# EAGLE design HendiRemoteInterface_v010 (EAGLE 9.5.2)
Wifi2Dmx Bridge WeMos D1 mini MAX485 (SO8) Neutrik NC1FAH1 5050 RGB LED BESTELLT: 30.06.2020
DNAME: Ruemmler, Elias
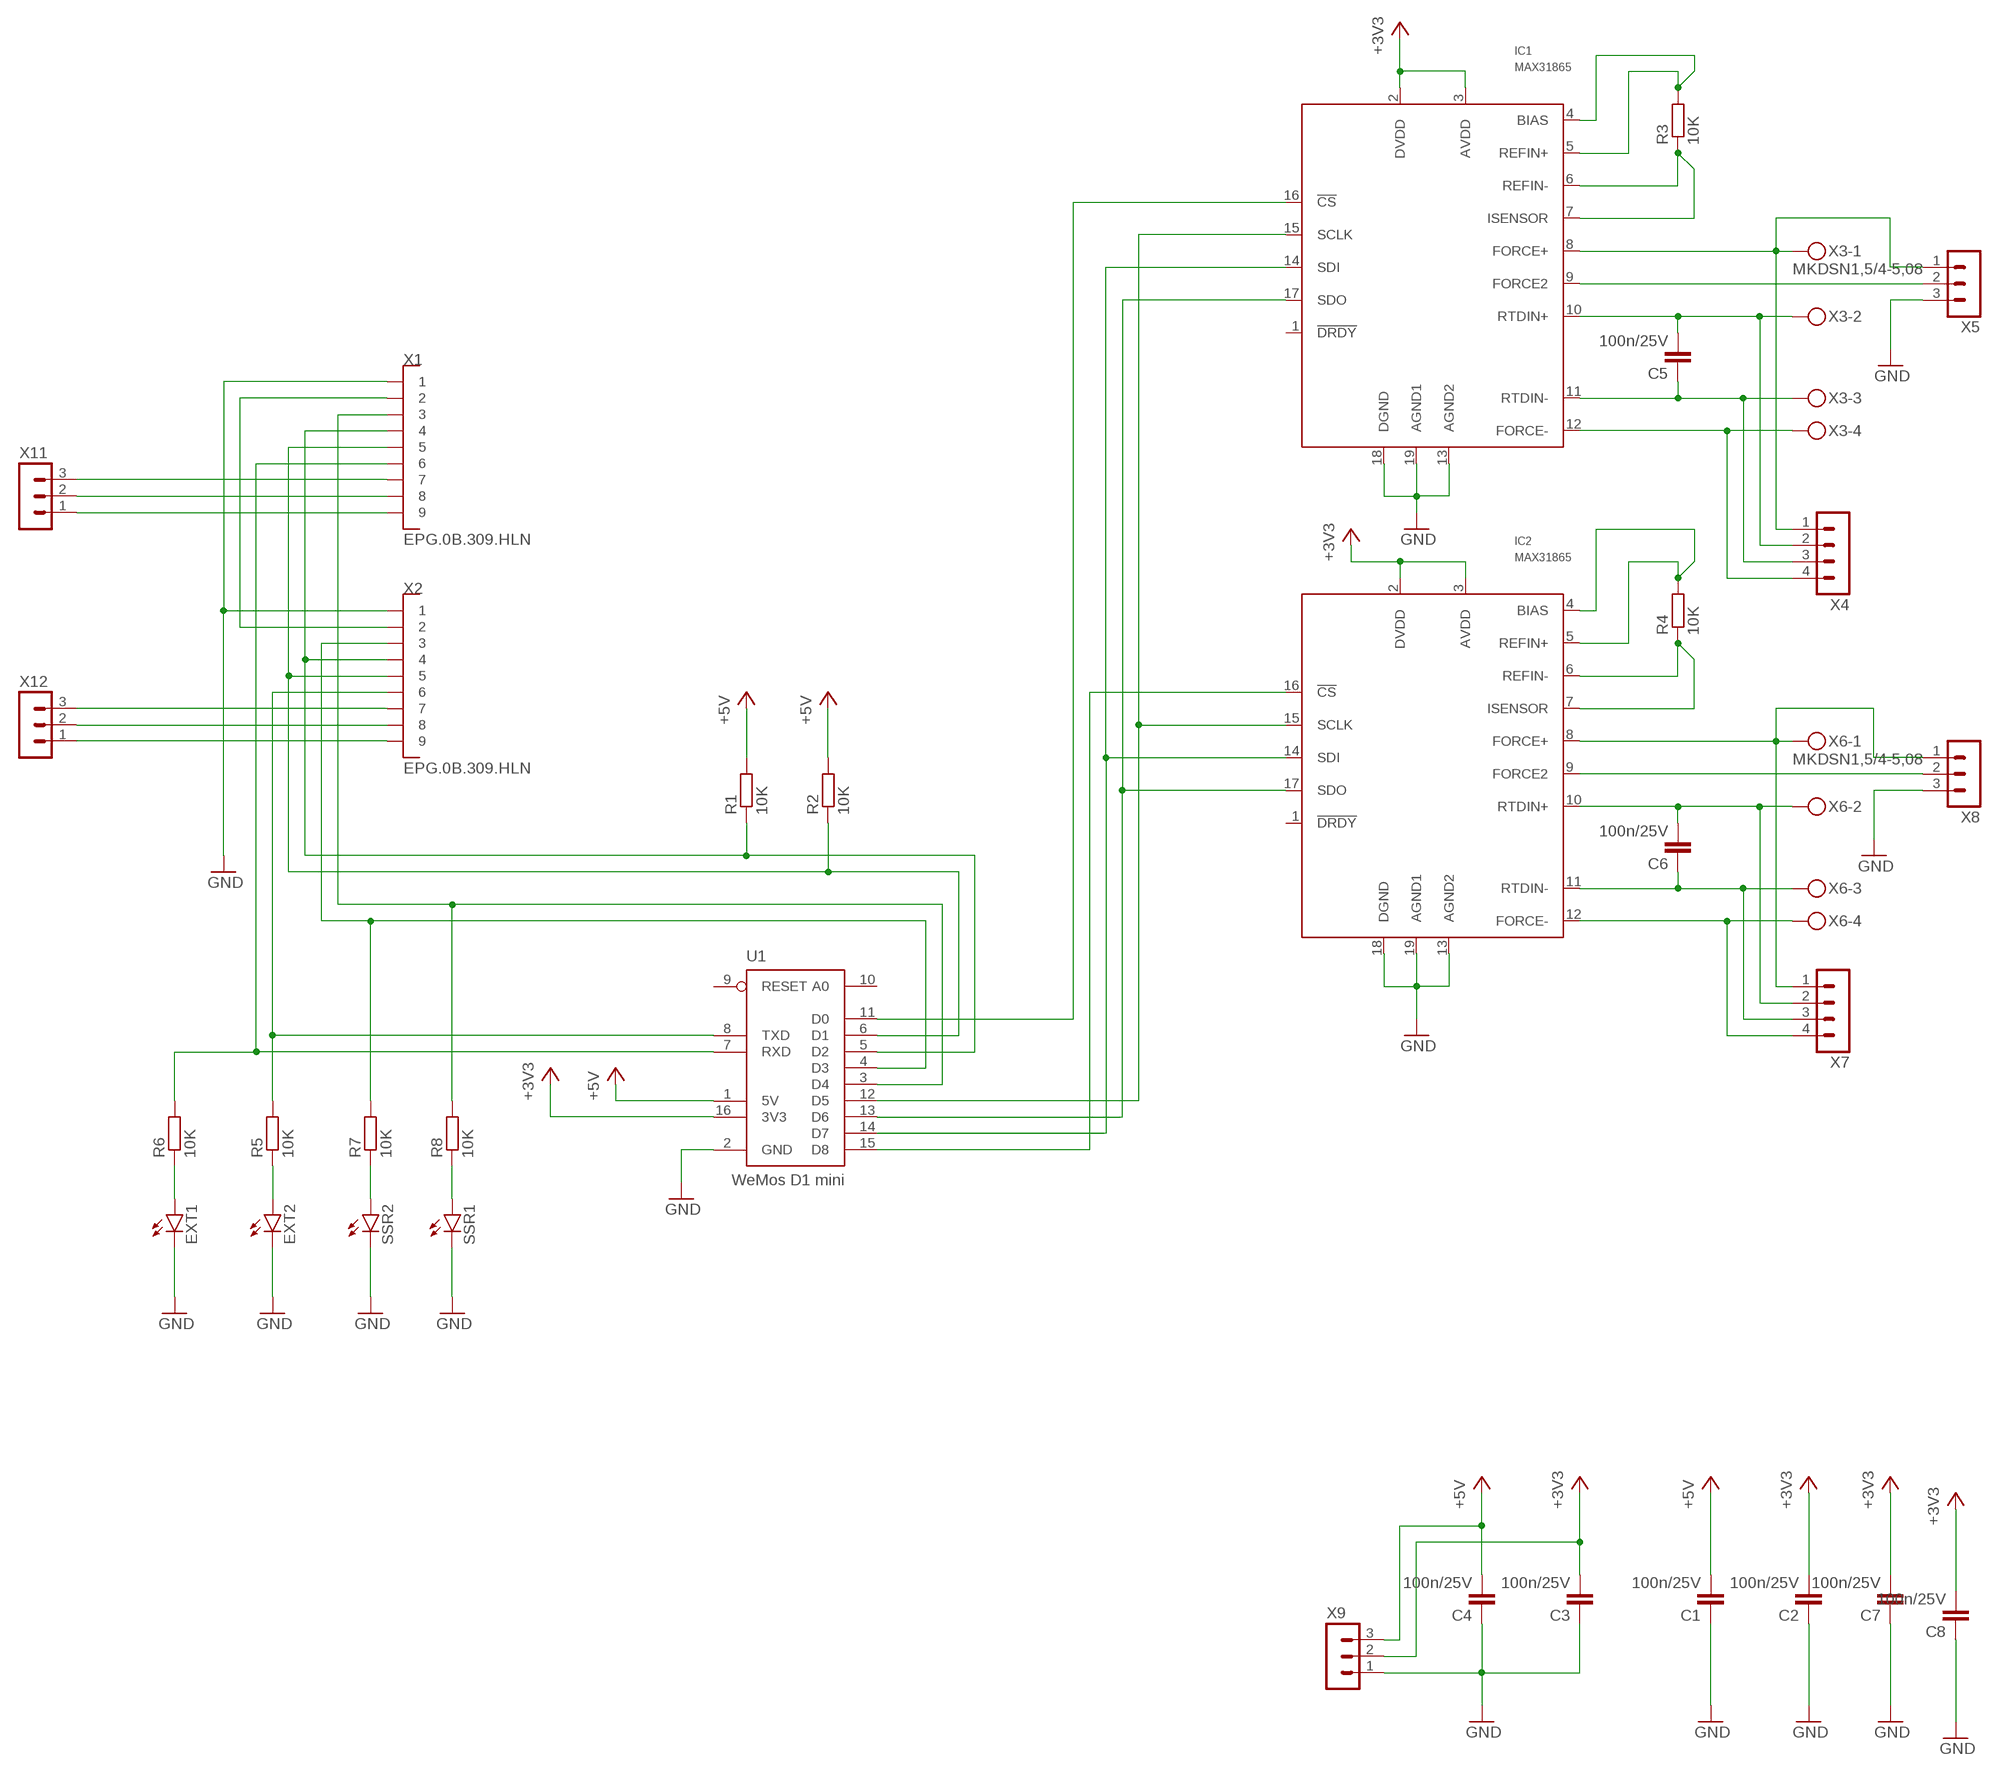
[diagram p0: schematic, sheet 1]

## Parts
C1  100n/25V  C-EUC0805  [C0805]
C2  100n/25V  C-EUC0805  [C0805]
C3  100n/25V  C-EUC0805  [C0805]
C4  100n/25V  C-EUC0805  [C0805]
C5  100n/25V  C-EUC0805  [C0805]
C6  100n/25V  C-EUC0805  [C0805]
C7  100n/25V  C-EUC0805  [C0805]
C8  100n/25V  C-EUC0805  [C0805]
EXT1  LEDCHIP-LED0805  [CHIP-LED0805]
EXT2  LEDCHIP-LED0805  [CHIP-LED0805]
IC1  MAX31865  MAX31865-SSOPSSOP  [SSOP20]
IC2  MAX31865  MAX31865-SSOPSSOP  [SSOP20]
R1  10K  R-EU_R0805  [R0805]
R2  10K  R-EU_R0805  [R0805]
R3  10K  R-EU_R0805  [R0805]
R4  10K  R-EU_R0805  [R0805]
R5  10K  R-EU_R0805  [R0805]
R6  10K  R-EU_R0805  [R0805]
R7  10K  R-EU_R0805  [R0805]
R8  10K  R-EU_R0805  [R0805]
SSR1  LEDCHIP-LED0805  [CHIP-LED0805]
SSR2  LEDCHIP-LED0805  [CHIP-LED0805]
U1  WeMos D1 mini  D1_MINI  [D1_MINI]
X1  EPG.0B.309.HLN  [P19-EPG-EXG-0B.309]
X2  EPG.0B.309.HLN  [P19-EPG-EXG-0B.309]
X3  MKDSN1,5/4-5,08  [MKDSN1,5/4-5,08]
X4  MA04-1  [MA04-1]
X5  MA03-1  [MA03-1]
X6  MKDSN1,5/4-5,08  [MKDSN1,5/4-5,08]
X7  MA04-1  [MA04-1]
X8  MA03-1  [MA03-1]
X9  MA03-1  [MA03-1]
X11  MA03-1  [MA03-1]
X12  MA03-1  [MA03-1]

## Nets
+3V3: C2.2 C3.2 C7.2 C8.2 IC1.2(DVDD) IC1.3(AVDD) IC2.2(DVDD) IC2.3(AVDD) U1.16(3V3) X9.2
+5V: C1.2 C4.2 R1.2 R2.2 U1.1(5V) X9.3
CLK: IC1.15(SCLK) IC2.15(SCLK) U1.12(D5)
CS1: IC1.16(!CS) U1.11(D0)
CS2: IC2.16(!CS) U1.15(D8)
GND: C1.1 C2.1 C3.1 C4.1 C7.1 C8.1 EXT1.C EXT2.C IC1.13(AGND2) IC1.18(DGND) IC1.19(AGND1) IC2.13(AGND2) IC2.18(DGND) IC2.19(AGND1) SSR1.C SSR2.C U1.2(GND) X1.1 X2.1 X5.3 X8.3 X9.1
N$1: X1.8 X11.2
N$2: X1.7 X11.3
N$3: X1.9 X11.1
N$4: R2.1 U1.6(D1) X1.5 X2.5
N$5: X1.2 X2.2
N$6: X2.7 X12.3
N$7: X2.8 X12.2
N$8: X2.9 X12.1
N$9: EXT2.A R5.1
N$10: EXT1.A R6.1
N$11: R1.1 U1.5(D2) X1.4 X2.4
N$12: R7.2 U1.4(D3) X2.3
N$13: R8.2 U1.3(D4) X1.3
N$14: R5.2 U1.8(TXD) X2.6
N$15: R6.2 U1.7(RXD) X1.6
N$16: IC2.8(FORCE+) X6.1 X7.1 X8.1
N$17: C6.2 IC2.10(RTDIN+) X6.2 X7.2
N$18: C6.1 IC2.11(RTDIN-) X6.3 X7.3
N$19: IC2.12(FORCE-) X6.4 X7.4
N$20: IC1.8(FORCE+) X3.1 X4.1 X5.1
N$21: C5.2 IC1.10(RTDIN+) X3.2 X4.2
N$22: C5.1 IC1.11(RTDIN-) X3.3 X4.3
N$23: IC1.12(FORCE-) X3.4 X4.4
N$24: IC1.9(FORCE2) X5.2
N$25: IC2.9(FORCE2) X8.2
N$26: IC1.6(REFIN-) IC1.7(ISENSOR) R3.1
N$27: IC1.4(BIAS) IC1.5(REFIN+) R3.2
N$28: IC2.6(REFIN-) IC2.7(ISENSOR) R4.1
N$29: IC2.4(BIAS) IC2.5(REFIN+) R4.2
N$30: R7.1 SSR2.A
N$31: R8.1 SSR1.A
SDI: IC1.14(SDI) IC2.14(SDI) U1.14(D7)
SDO: IC1.17(SDO) IC2.17(SDO) U1.13(D6)
Unconnected: IC1.1(!DRDY) IC2.1(!DRDY) U1.9(RESET) U1.10(A0)

## Power pins joined to a net without a drawn wire
GND: X1.A(GND) X1.B(GND) X1.C(GND) X1.D(GND) X2.A(GND) X2.B(GND) X2.C(GND) X2.D(GND)

## Library data of the parts
C1-C8 = rcl:C-EU: CAPACITOR, European symbol; SPICEPREFIX: C
EXT1 EXT2 SSR1 SSR2 = led:LED: LED OSRAM: - CHIPLED LG R971, LG N971, LY N971, LG Q971, LY Q971, LO R971, LY R971 LH N974, LH R974 LS Q976, LO Q976, LY Q976 LO Q996 - Hyper CHIPLED LW Q18S LB Q993, LB Q99A, LB R99A - SideLED LS A670, LO A670, LY A670, LG A670, LP A670 LB A673, LV A673, LT A673, LW A673 LH A674 LY A675 LS A676, LA A676, LO A676, LY A676, LW A676 LS A679, LY A679, LG A679 - Hyper Micro SIDELED® LS Y876, LA Y876, LO Y876, LY Y876 LT Y87S - SmartLED LW L88C, LW L88S LB L89C, LB L89S, LG L890 LS L89K, LO L89K, LY L89K LS L896, LA L896, LO L896, LY L896 - TOPLED LS T670, LO T670, LY T670, LG T670, LP T670 LSG T670, LSP T670, LSY T670, LOP T670, LYG T670 LG T671, LOG T671, LSG T671 LB T673, LV T673, LT T673, LW T673 LH T674 LS T676, LA T676, LO T676, LY T676, LB T676, LH T676, LSB T676, LW T676 LB T67C, LV T67C, LT T67C, LS T67K, LO T67K, LY T67K, LW E67C LS E67B, LA E67B, LO E67B, LY E67B, LB E67C, LV E67C, LT E67C LW T67C LS T679, LY T679, LG T679 LS T770, LO T770, LY T770, LG T770, LP T770 LB T773, LV T773, LT T773, LW T773 LH T774 LS E675, LA E675, LY E675, LS T675 LS T776, LA T776, LO T776, LY T776, LB T776 LHGB T686 LT T68C, LB T68C - Hyper Mini TOPLED® LB M676 - Mini TOPLED Santana® LG M470 LS M47K, LO M47K, LY M47K Source: http://www.osram.convergy.de LUXEON: - LUMILED® LXK2-PW12-R00, LXK2-PW12-S00, LXK2-PW14-U00, LXK2-PW14-V00 LXK2-PM12-R00, LXK2-PM12-S00, LXK2-PM14-U00 LXK2-PE12-Q00, LXK2-PE12-R00, LXK2-PE12-S00, LXK2-PE14-T00, LXK2-PE14-U00 LXK2-PB12-K00, LXK2-PB12-L00, LXK2-PB12-M00, LXK2-PB14-N00, LXK2-PB14-P00, LXK2-PB14-Q00 LXK2-PR12-L00, LXK2-PR12-M00, LXK2-PR14-Q00, LXK2-PR14-R00 LXK2-PD12-Q00, LXK2-PD12-R00, LXK2-PD12-S00 LXK2-PH12-R00, LXK2-PH12-S00 LXK2-PL12-P00, LXK2-PL12-Q00, LXK2-PL12-R00 Source: www.luxeon.com KINGBRIGHT: KA-3528ASYC Source: www.kingbright.com
IC1 IC2 = MAX31865:MAX31865-SSOP
R1-R8 = rcl:R-EU_: RESISTOR, European symbol; SPICEPREFIX: R
U1 = rca-wemos:D1_MINI
X1 X2 = con-lemo_eh2:EPG.0B.309.HLN
X3 X6 = con-phoenix-508:MKDSN1,5/4-5,08: MKDSN 1,5/ 4-5,08 Printklemme Nennstrom: 13,5 A Nennspannung: 250 V Rastermaß: 5,08 mm Polzahl: 4 Anschlussart: Schraubanschluss Montage: Löten Anschlussrichtung Leiter/Platine: 0 ° Artikelnummer: 1729144 Source: http://eshop.phoenixcontact.com .. 1729144.pdf
X4 X7 = con-lstb:MA04-1: PIN HEADER; OC_FARNELL: unknown; OC_NEWARK: unknown
X5 X8 X9 X11 X12 = con-lstb:MA03-1: PIN HEADER; OC_FARNELL: unknown; OC_NEWARK: unknown

## Net classes
0 default: clearance 0.305 mm

## Board
Wifi2Dmx Bridge WeMos D1 mini MAX485 (SO8) Neutrik NC1FAH1 5050 RGB LED BESTELLT: 30.06.2020
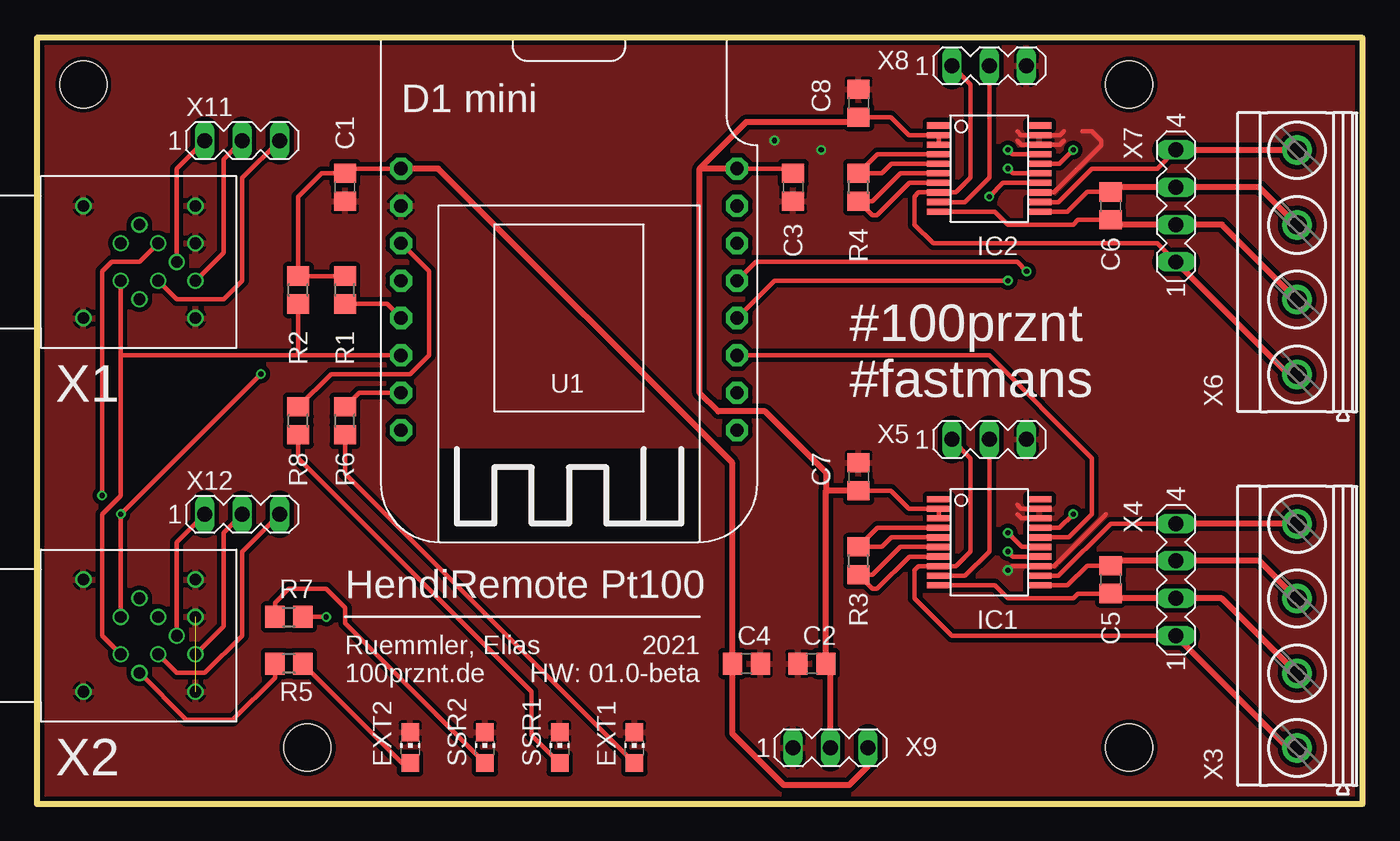
[diagram p1: board, top side]
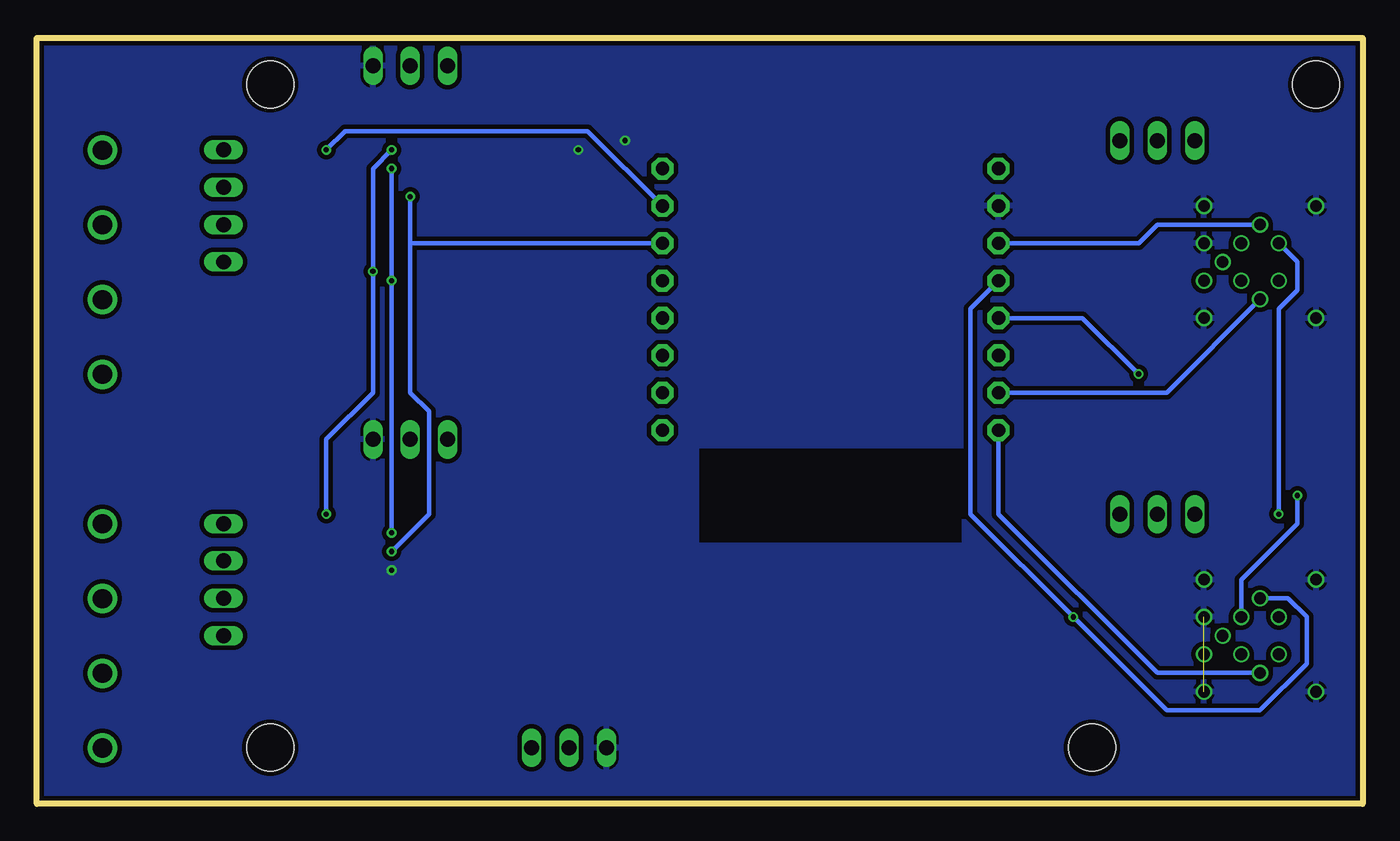
[diagram p2: board, bottom side, seen from below]

Size 90.17 x 52.07 mm. Coordinates in mm from the lower left corner, seen from the top.
Outline: 0,0 90.17,0 90.17,52.07 0,52.07 0,0
Copper layers (1*16): Top 0.035mm / dielectric 1.6mm / Bottom 0.035mm
Design rules "JLCPCB_doublelayer": minimum track width 5mil, minimum drill 0.3mm, track to track 5mil, track to pad 5mil, pad to pad 5mil, via to via 5mil, smd to smd 5mil, copper to edge 0.3mm, drill to drill 0.2mm, minimum pad ring 0.15mm, minimum via ring 0.15mm, stop-mask expansion 0.075mm, vias tented up to drill 0mil, thermal gap 0.2mm
Holes 3.2 mm at 3.18,48.89 18.42,3.81 74.3,3.81 74.3,48.89

### Footprints (pad centres in the part's own frame; a part is rotated, then mirrored left to right if it is on the bottom)
C0805 = smd 1.3 x 1.5: 1 -0.95,0; 2 0.95,0
CHIP-LED0805 = smd 1.2 x 1.2: A 0,-1.05; C 0,1.05
SSOP20 = smd 0.42 x 1.62: 1 -2.925,-3.425; 2 -2.275,-3.425; 3 -1.625,-3.425; 4 -0.975,-3.425; 5 -0.325,-3.425; 6 0.325,-3.425; 7 0.975,-3.425; 8 1.625,-3.425; 9 2.275,-3.425; 10 2.925,-3.425; 11 2.925,3.425; 12 2.275,3.425; 13 1.625,3.425; 14 0.975,3.425; 15 0.325,3.425; 16 -0.325,3.425; 17 -0.975,3.425; 18 -1.625,3.425; 19 -2.275,3.425; 20 -2.925,3.425
R0805 = smd 1.3 x 1.5: 1 -0.95,0; 2 0.95,0
D1_MINI = drill 0.9 pad 1.5 octagon: 1 11.43,0; 2 11.43,2.54; 3 11.43,5.08; 4 11.43,7.62; 5 11.43,10.16; 6 11.43,12.7; 7 11.43,15.24; 8 11.43,17.78; 9 -11.43,17.78; 10 -11.43,15.24; 11 -11.43,12.7; 12 -11.43,10.16; 13 -11.43,7.62; 14 -11.43,5.08; 15 -11.43,2.54; 16 -11.43,0
P19-EPG-EXG-0B.309 = drill 0.8: 1 -7.62,-1.27; 2 -5.08,-1.27; 3 -3.81,-2.54; 4 -2.54,-1.27; 5 -2.54,1.27; 6 -3.81,2.54; 7 -5.08,1.27; 8 -7.62,1.27; 9 -6.35,0; A -7.62,-3.81; B 0,-3.81; C 0,3.81; D -7.62,3.81
MKDSN1,5/4-5,08 = drill 1.3 pad 2: 1 -7.641,0.025; 2 -2.561,0.025; 3 2.519,0.025; 4 7.599,0.025
MA04-1 = drill 1.016 long: 1 -3.81,0; 2 -1.27,0; 3 1.27,0; 4 3.81,0
MA03-1 = drill 1.016 long: 1 -2.54,0; 2 0,0; 3 2.54,0

### Placement (x,y rotation side)
C1  20.96,41.91 90 top
C2  52.7,9.52 0 top
C3  51.44,41.91 90 top
C4  48.26,9.52 180 top
C5  73.02,15.24 270 top
C6  73.02,40.64 270 top
C7  55.88,22.23 270 top
C8  55.88,47.62 270 top
EXT1  40.64,3.81 0 top
EXT2  25.4,3.81 0 top
IC1  64.77,17.78 270 top
IC2  64.77,43.18 270 top
R1  20.96,34.92 90 top
R2  17.78,34.92 90 top
R3  55.88,16.51 90 top
R4  55.88,41.91 90 top
R5  17.14,9.52 180 top
R6  20.96,26.03 90 top
R7  17.14,12.7 0 top
R8  17.78,26.03 90 top
SSR1  35.56,3.81 0 top
SSR2  30.48,3.81 0 top
U1  36.2,43.18 180 top
X1  3.18,36.83 180 top
X2  3.18,11.43 180 top
X3  85.72,11.43 90 top
X4  77.47,15.24 90 top
X5  64.77,24.77 0 top
X6  85.72,36.83 90 top
X7  77.47,40.64 90 top
X8  64.77,50.16 0 top
X9  53.97,3.81 0 top
X11  13.97,45.09 0 top
X12  13.97,19.69 0 top

### Tracks (layer width: path | path; a pad name or v marks a point on that pad's centre or on a via)
+3V3
  Top 0.305: IC2.3 IC2.2 59.32,45.45 58.1,46.67 C8.2 | IC1.3 IC1.2 59.32,20.05 58.1,21.27 C7.2 | U1.16 51.11,43.18 C3.2 | 53.81,9.36 C2.2
  Top 0.406: X9.2 53.97,9.2 53.81,9.36 | C7.2 53.66,21.27 | 53.66,21.27 53.66,22.55 49.53,26.67 46.36,26.67 45.08,27.94 45.08,43.18 | C2.2 53.66,21.27 | U1.16 45.08,43.18 | 45.08,43.18 48.26,46.35 55.56,46.35 C8.2
+5V
  Top 0.305: R1.2 R2.2 17.78,41.27 19.36,42.86 C1.2 21.28,43.18 U1.1
  Top 0.406: X9.3 56.52,2.54 55.25,1.27 50.8,1.27 47.31,4.76 C4.2 47.31,23.17 27.31,43.18 U1.1
CLK  (via drill 0.35)
  Top 0.305: IC2.15 66.36,42.85 v66.04,43.18 | IC1.15 67,17.45 v66.04,18.41 | v66.04,35.56 50.16,35.56 U1.12
  Bottom 0.305: v66.04,43.18 v66.04,35.56 v66.04,18.41
CS1
  Top 0.305: U1.11 64.77,30.48 71.75,23.49 71.75,19.69 70.17,18.11 IC1.16
CS2  (via drill 0.35)
  Top 0.305: IC2.16 69.54,43.51 v70.48,44.45
  Bottom 0.305: v70.48,44.45 69.22,45.72 52.7,45.72 U1.15
GND  (via drill 0.35)  (1 unrouted)
  Top 0.305: IC1.19 66.94,20.05 66.67,20.32 | IC1.18 66.95,19.41 66.67,19.69 | 72.71,19.69 69.18,16.15 IC1.13 66.32,16.15 v66.04,15.88 | 66.67,45.72 66.94,45.45 IC2.19 69.58,45.45 69.85,45.72 | 66.67,45.09 66.95,44.8 IC2.18 69.57,44.8 69.85,45.09 | IC2.13 69.18,41.55 72.39,44.77 72.39,45.09 71.75,45.72 71.12,45.72
  other vias: 50.16,45.09 53.34,44.45
  pour Top: 0,52.07 0,0 90.17,0 90.17,52.07
  pour Bottom: 0,52.07 0,0 90.17,0 90.17,52.07
N$1
  Top 0.305: X1.8 12.7,37.46 12.7,43.81 X11.2
N$2
  Top 0.305: X1.7 9.53,34.29 12.7,34.29 13.97,35.56 13.97,42.55 X11.3
N$3
  Top 0.305: X1.9 9.53,43.18 X11.1
N$4
  Top 0.305: X1.5 5.71,30.48 | 5.71,30.48 5.71,20.95 4.45,19.69 4.45,11.43 X2.5 | U1.6 17.78,30.48 | 17.78,30.48 5.71,30.48 | R2.1 17.78,30.48
N$5  (via drill 0.35)
  Top 0.305: X1.2 6.99,36.83 5.08,36.83 4.45,36.2 v4.45,20.95
  Bottom 0.305: v4.45,20.95 4.45,19.05 8.26,15.24 X2.2
N$6
  Top 0.305: X2.7 9.53,8.89 11.43,8.89 13.97,11.43 13.97,17.14 X12.3
N$7
  Top 0.305: X2.8 12.7,12.06 12.7,18.41 X12.2
N$8
  Top 0.305: X2.9 9.53,17.78 X12.1
N$9
  Top 0.305: EXT2.A 24.86,2.76 R5.1
N$10
  Top 0.305: EXT1.A 20.96,22.45 R6.1
N$11  (via drill 0.35)
  Top 0.305: X2.4 v5.71,19.69 v15.24,29.21 | R1.1 23.81,33.98 U1.5
  Bottom 0.305: v5.71,19.69 5.71,33.66 4.45,34.92 4.45,36.83 X1.4 | U1.5 19.05,33.02 v15.24,29.21
N$12  (via drill 0.35)
  Top 0.305: v19.68,12.7 R7.2
  Bottom 0.305: X2.3 5.08,13.97 3.81,12.7 3.81,9.52 6.99,6.35 13.34,6.35 v19.68,12.7 26.67,19.69 26.67,33.66 U1.4
N$13
  Top 0.305: R8.2 20,29.21 25.4,29.21 26.67,30.48 26.67,36.2 U1.3
  Bottom 0.305: U1.3 15.24,38.1 13.97,39.37 X1.3
N$14
  Top 0.305: R5.2 16.2,8.57 13.34,5.71 10.16,5.71 X2.6
  Bottom 0.305: X2.6 13.97,8.89 24.77,19.69 U1.8
N$15
  Top 0.305: R6.2 21.91,27.94 U1.7
  Bottom 0.305: X1.6 13.34,27.94 U1.7
N$16
  Top 0.305: X7.1 76.2,38.1 60.96,38.1 59.69,39.37 59.69,41.27 59.97,41.55 IC2.8 62.51,41.55 63.5,42.55 63.5,48.89 X8.1
  Top 0.406: X6.1 85.11,29.19 X7.1
N$17
  Top 0.305: C6.2 70.8,39.69 70.48,39.37 66.04,39.37 65.16,40.26 IC2.10
  Top 0.406: C6.2 73.34,39.37 X7.2 80.6,39.37 X6.2
N$18
  Top 0.305: C6.1 71.44,41.59 70.1,40.26 IC2.11
  Top 0.406: C6.1 73.34,41.91 X7.3 83.14,41.91 X6.3
N$19
  Top 0.305: X7.4 76.2,43.18 71.75,43.18 69.48,40.91 IC2.12
  Top 0.406: X6.4 77.49,44.43 X7.4
N$20
  Top 0.305: X4.1 62.23,11.43 59.69,13.97 59.69,15.88 59.97,16.15 IC1.8 62.51,16.15 63.5,17.14 63.5,23.49 X5.1
  Top 0.406: X3.1 85.11,3.79 X4.1
N$21
  Top 0.305: IC1.10 65.16,14.86 66.04,13.97 70.48,13.97 70.8,14.29 C5.2
  Top 0.406: C5.2 73.34,13.97 X4.2 80.6,13.97 X3.2
N$22
  Top 0.305: C5.1 71.44,16.19 70.1,14.86 IC1.11
  Top 0.406: C5.1 73.34,16.51 X4.3 83.14,16.51 X3.3
N$23
  Top 0.305: IC1.12 69.48,15.5 73.02,19.05 X4.4
  Top 0.406: X3.4 77.49,19.03 X4.4
N$24
  Top 0.305: X5.2 64.77,17.14 63.13,15.5 IC1.9
N$25
  Top 0.305: X8.2 64.77,42.55 63.13,40.91 IC2.9
N$26
  Top 0.305: IC1.7 59.35,16.8 57.15,14.61 56.83,14.61 R3.1 56.83,15.56 58.73,17.45 IC1.6
N$27
  Top 0.305: IC1.5 58.11,18.11 57.47,17.46 R3.2 57.17,18.76 IC1.4
N$28
  Top 0.305: IC2.6 58.73,42.85 56.83,40.96 R4.1 | R4.1 56.19,40.96 | IC2.7 59.35,42.2 57.15,40.01 56.83,40.01 R4.1
N$29
  Top 0.305: IC2.4 57.17,44.16 R4.2 57.47,42.86 58.11,43.51 IC2.5
N$30
  Top 0.305: R7.1 16.2,13.65 17.14,14.61 19.68,14.61 20.96,13.34 20.96,12.29 SSR2.A
N$31
  Top 0.305: SSR1.A 33.66,4.66 33.66,7.62 17.78,23.49 R8.1
SDI  (via drill 0.35)
  Top 0.305: IC2.14 65.7,42.2 v64.77,41.27 | v66.04,17.14 66.38,16.8 IC1.14
  Bottom 0.305: v64.77,41.27 64.77,38.1 | 64.77,38.1 64.77,27.94 63.5,26.67 63.5,19.69 v66.04,17.14 | U1.14 64.77,38.1
SDO  (via drill 0.35)
  Top 0.305: IC2.17 66.33,44.16 v66.04,44.45 | IC1.17 69.55,18.76 v70.48,19.69 | v67.31,36.2 66.67,36.83 48.89,36.83 U1.13
  Bottom 0.305: v66.04,44.45 67.31,43.18 v67.31,36.2 67.31,27.94 70.48,24.77 v70.48,19.69

### Text on the board
tPlace: #100prznt / #fastmans | HendiRemote Pt100 | Ruemmler, Elias / 100prznt.de | 2021 / HW: 01.0-beta